# Altium schematic sheet FPGA_NuHorizons_CoolRunnerII_Dev_Board_Rev2.SchDoc: Example for NuHorizons CoolRunner-II Dev. Board
size B; Organization: Altium Limited; Address1: L3, 12a Rodborough Rd; Address2: Frenchs Forest; Address3: NSW; Address4: Australia 2086; DocumentNumber: 1; SheetNumber: 1; SheetTotal: 2
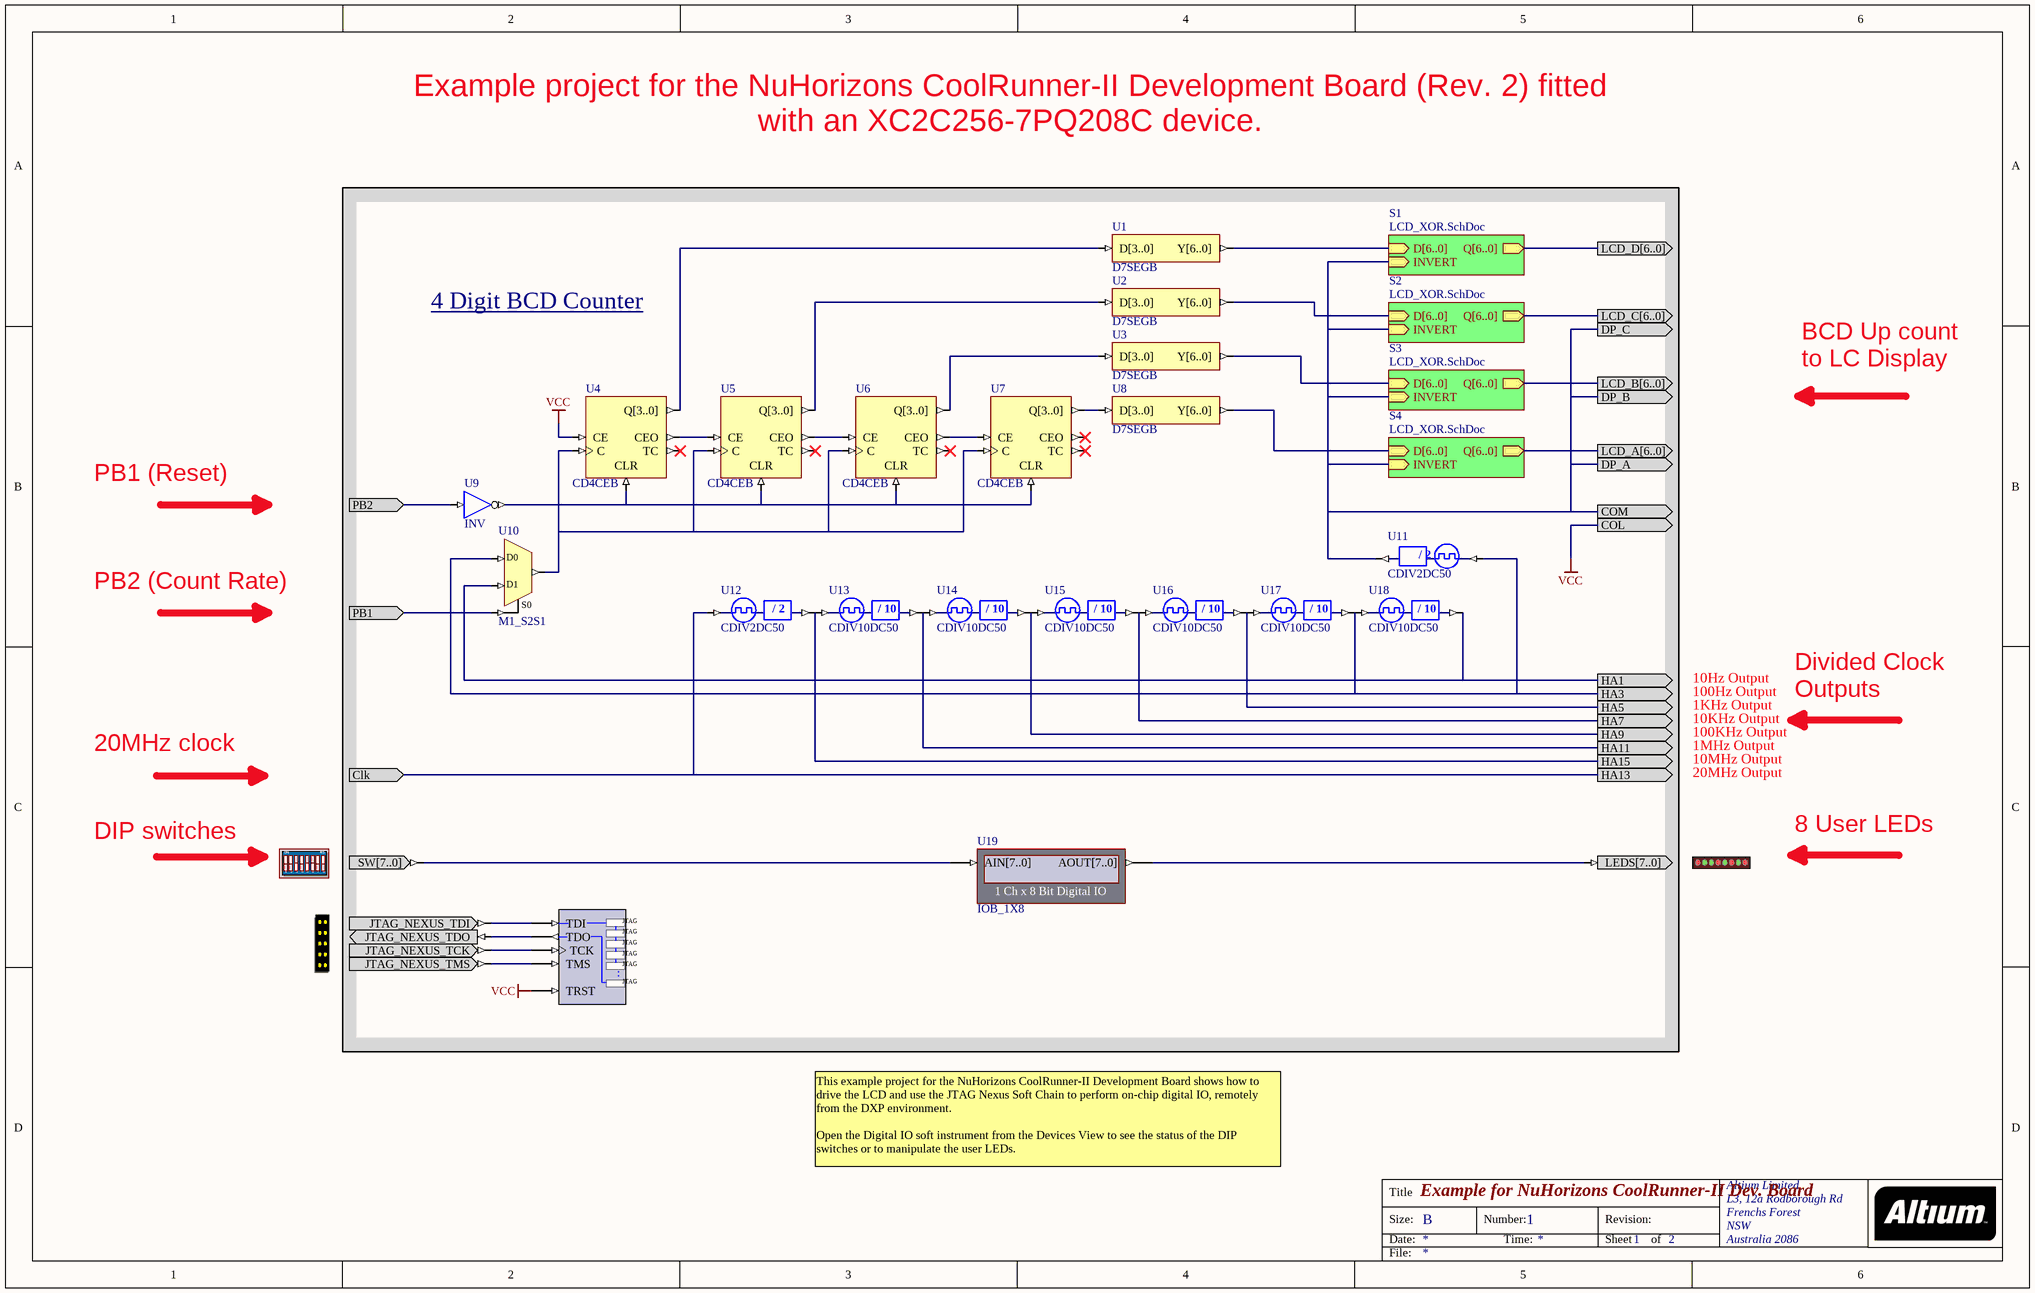
[diagram p0: FPGA_NuHorizons_CoolRunnerII_Dev_Board_Rev2.SchDoc]

## Parts
(Parts that share a designator on the sheet are numbered #1, #2 ... from top to bottom, then left to right.)
?#1  LED  (value not drawn)
?#2  DIPSWITCH  (value not drawn)
?#3  NEXUS_JTAG_CONNECTOR  (value not drawn)
NEXUS_JTAG_PORT  NEXUS_JTAG_PORT  (value not drawn)
U1  D7SEGB
U2  D7SEGB
U3  D7SEGB
U4  CD4CEB
U5  CD4CEB
U6  CD4CEB
U7  CD4CEB
U8  D7SEGB
U9  INV
U10  M1_S2S1
U11  CDIV2DC50
U12  CDIV2DC50
U13  CDIV10DC50
U14  CDIV10DC50
U15  CDIV10DC50
U16  CDIV10DC50
U17  CDIV10DC50
U18  CDIV10DC50
U19  IOB_1X8

## Blocks framed on the sheet
4 Digit BCD Counter: ?#1-?#3 NEXUS_JTAG_PORT U1-U19

## Sub-sheets
S1 = LCD_XOR.SchDoc: D[6..0] (in), Q[6..0] (out), INVERT (in)
S2 = LCD_XOR.SchDoc: D[6..0] (in), Q[6..0] (out), INVERT (in)
S3 = LCD_XOR.SchDoc: D[6..0] (in), Q[6..0] (out), INVERT (in)
S4 = LCD_XOR.SchDoc: D[6..0] (in), Q[6..0] (out), INVERT (in)

## Ports
Clk (in), COL (out), COM (out), DP_A (out), DP_B (out), DP_C (out), HA1 (out), HA3 (out), HA5 (out), HA7 (out), HA9 (out), HA11 (out), HA13 (out), HA15 (out), LCD_A[6..0] (out), LCD_B[6..0] (out), LCD_C[6..0] (out), LCD_D[6..0] (out), PB1 (in), PB2 (in)

## Nets
VCC: NEXUS_JTAG_PORT.TRST U4.CE ; port COL
Clk: U12.CLKIN ; port Clk, port HA13
COM: U11.CLKDV ; port COM, port DP_C, port DP_B, port DP_A, sheet S2/INVERT, sheet S1/INVERT, sheet S3/INVERT, sheet S4/INVERT
HA1: U10.D1 U18.CLKDV ; port HA1
HA3: U10.D0 U11.CLKIN U17.CLKDV U18.CLKIN ; port HA3
HA5: U16.CLKDV U17.CLKIN ; port HA5
HA7: U15.CLKDV U16.CLKIN ; port HA7
HA9: U14.CLKDV U15.CLKIN ; port HA9
HA11: U13.CLKDV U14.CLKIN ; port HA11
HA15: U12.CLKDV U13.CLKIN ; port HA15
PB1: U10.S0 ; port PB1
PB2: U9.I ; port PB2
Net?#1_LEDS[7..0]: ?#1.LEDS[7..0] U19.AOUT[7..0]
Net?#2_SW[7..0]: ?#2.SW[7..0] U19.AIN[7..0]
Net?#3_JTAG_NEXUS_TCK: ?#3.JTAG_NEXUS_TCK NEXUS_JTAG_PORT.TCK
Net?#3_JTAG_NEXUS_TDI: ?#3.JTAG_NEXUS_TDI NEXUS_JTAG_PORT.TDI
Net?#3_JTAG_NEXUS_TDO: ?#3.JTAG_NEXUS_TDO NEXUS_JTAG_PORT.TDO
Net?#3_JTAG_NEXUS_TMS: ?#3.JTAG_NEXUS_TMS NEXUS_JTAG_PORT.TMS
NetU1_D[3..0]: U1.D[3..0] U4.Q[3..0]
NetU1_Y[6..0]: U1.Y[6..0] ; sheet S1/D[6..0]
NetU2_D[3..0]: U2.D[3..0] U5.Q[3..0]
NetU2_Y[6..0]: U2.Y[6..0] ; sheet S2/D[6..0]
NetU3_D[3..0]: U3.D[3..0] U6.Q[3..0]
NetU3_Y[6..0]: U3.Y[6..0] ; sheet S3/D[6..0]
NetU4_C: U4.C U5.C U6.C U7.C U10.O
NetU4_CEO: U4.CEO U5.CE
NetU4_CLR: U4.CLR U5.CLR U6.CLR U7.CLR U9.O
NetU5_CEO: U5.CEO U6.CE
NetU6_CEO: U6.CEO U7.CE
NetU7_Q[3..0]: U7.Q[3..0] U8.D[3..0]
NetU8_Y[6..0]: U8.Y[6..0] ; sheet S4/D[6..0]

Not connected (* = marked no-connect by the designer): U4 TC*; U5 TC*; U6 TC*; U7 CEO* TC*

## Buses and harness runs
bus port LCD_A[6..0] = sheet S4/Q[6..0]
bus port LCD_B[6..0] = sheet S3/Q[6..0]
bus port LCD_C[6..0] = sheet S2/Q[6..0]
bus port LCD_D[6..0] = sheet S1/Q[6..0]

## Notes on the sheet
- Example project for the NuHorizons CoolRunner-II Development Board (Rev. 2) fitted with an XC2C256-7PQ208C device.
- BCD Up count to LC Display
- PB1 (Reset)
- PB2 (Count Rate)
- 10Hz Output
- 100Hz Output
- 20MHz clock
- 1KHz Output
- 10KHz Output
- 100KHz Output
- 1MHz Output
- 10MHz Output
- 20MHz Output
- Divided Clock Outputs
- DIP switches
- 8 User LEDs
- This example project for the NuHorizons CoolRunner-II Development Board shows how to drive the LCD and use the JTAG Nexus Soft Chain to perform on-chip digital IO, remotely from the DXP environment.
  Open the Digital IO soft instrument from the Devices View to see the status of the DIP switches or to manipulate the user LEDs.
- Title
- Size:
- Date:
- B
- Number:
- Time:
- Revision:
- Sheet
- of
- File:
- (in symbol CDIV2DC50) / 2
- (in symbol CDIV10DC50) / 10
- (in symbol DIPSWITCH) ON; RS; 1; 2; 3; 4; 5; 6; 7; 8
- (in symbol NEXUS_JTAG_PORT) JTAG; .

## Library data of the parts
?#1 = LED: 8-Way LEDS; PortComponent: True; Published: 19-Nov-2003; Publisher: Altium Limited
?#2 = DIPSWITCH: 8-Way Dip Switch; PortComponent: True; Published: 19-Nov-2003; Publisher: Altium Limited
?#3 = NEXUS_JTAG_CONNECTOR: JTAG Port; PortComponent: True; Published: 19-Nov-2003; Publisher: Altium Limited
NEXUS_JTAG_PORT = NEXUS_JTAG_PORT: Nexus Processor JTAG Chain Connector; NEXUS_JTAG_CONNECTOR: True; Published: 18-Nov-2003; Publisher: Altium Limited
U1-U3 U8 = D7SEGB: 7-Segment-Display Decoder for Common-Cathode LED (Active High Output), Bus Version; SubClass: 7SEG; PortSize: 7; ArchiveName: GENERIC; VHDLIB_SIM: GENERIC_LIB; Published: 29-Jan-2004; Publisher: Altium Limited; LastRevisionNo: 1.00.00; HelpURL: CR0118 FPGA Generic Library Guide.pdf#page=161; FunctionalClass: Decoder; PortStyle: Bus Version
U4-U7 = CD4CEB: 4-Bit Cascadable BCD Counter with Clock Enable and Asynchronous Clear, Bus Version; ArchiveName: GENERIC; Published: 4-Dec-2003; Publisher: Altium Limited; Core Revision: 1.00.00
U9 = INV: Inverter; ArchiveName: GENERIC; Published: 4-Dec-2003; Publisher: Altium Limited; Xilinx Equivalent: INV; Core Revision: 1.00.00
U10 = M1_S2S1: 2x1-Single Wire to 1x1-Single Wire Multiplexer; Xilinx Equivalent: M2_1; ArchiveName: GENERIC; Published: 4-Dec-2003; Publisher: Altium Limited; Core Revision: 1.00.00
U11 = CDIV2DC50: Clock Divider by 2 with 50% Duty Cycle Output; XilinxEquivalent: CLK_DIV2; DivisorRate: 2; DutyCycle: 50; ArchiveName: GENERIC; VHDLIB_SIM: GENERIC_LIB; Published: 29-Jan-2004; Publisher: Altium Limited; LastRevisionNo: 1.00.00; HelpURL: CR0118 FPGA Generic Library Guide.pdf#page=142; FunctionalClass: Clock Divider
U12 = CDIV2DC50: Clock Divider by 2 with 50% Duty Cycle Output; Xilinx Equivalent: CLK_DIV2; ArchiveName: GENERIC; Published: 4-Dec-2003; Publisher: Altium Limited; Core Revision: 1.00.00
U13-U18 = CDIV10DC50: Clock Divider by 10 with 50% Duty Cycle Output; ArchiveName: GENERIC; Xilinx Equivalent: CLK_DIV10; Published: 4-Dec-2003; Publisher: Altium Limited; Core Revision: 1.00.00
U19 = IOB_1X8: 1 Ch x 8 Bit Digital IO; NEXUS_CORE: Instrument; NEXUS_JTAG_DEVICE: True; NEXUS_JTAG_ORDER: 0; Published: 30/09/2003; Publisher: Altium Hobart Technology Centre; Core Revision: 1.00.00